# EAGLE design i2c_buffer (EAGLE 9.4.2)
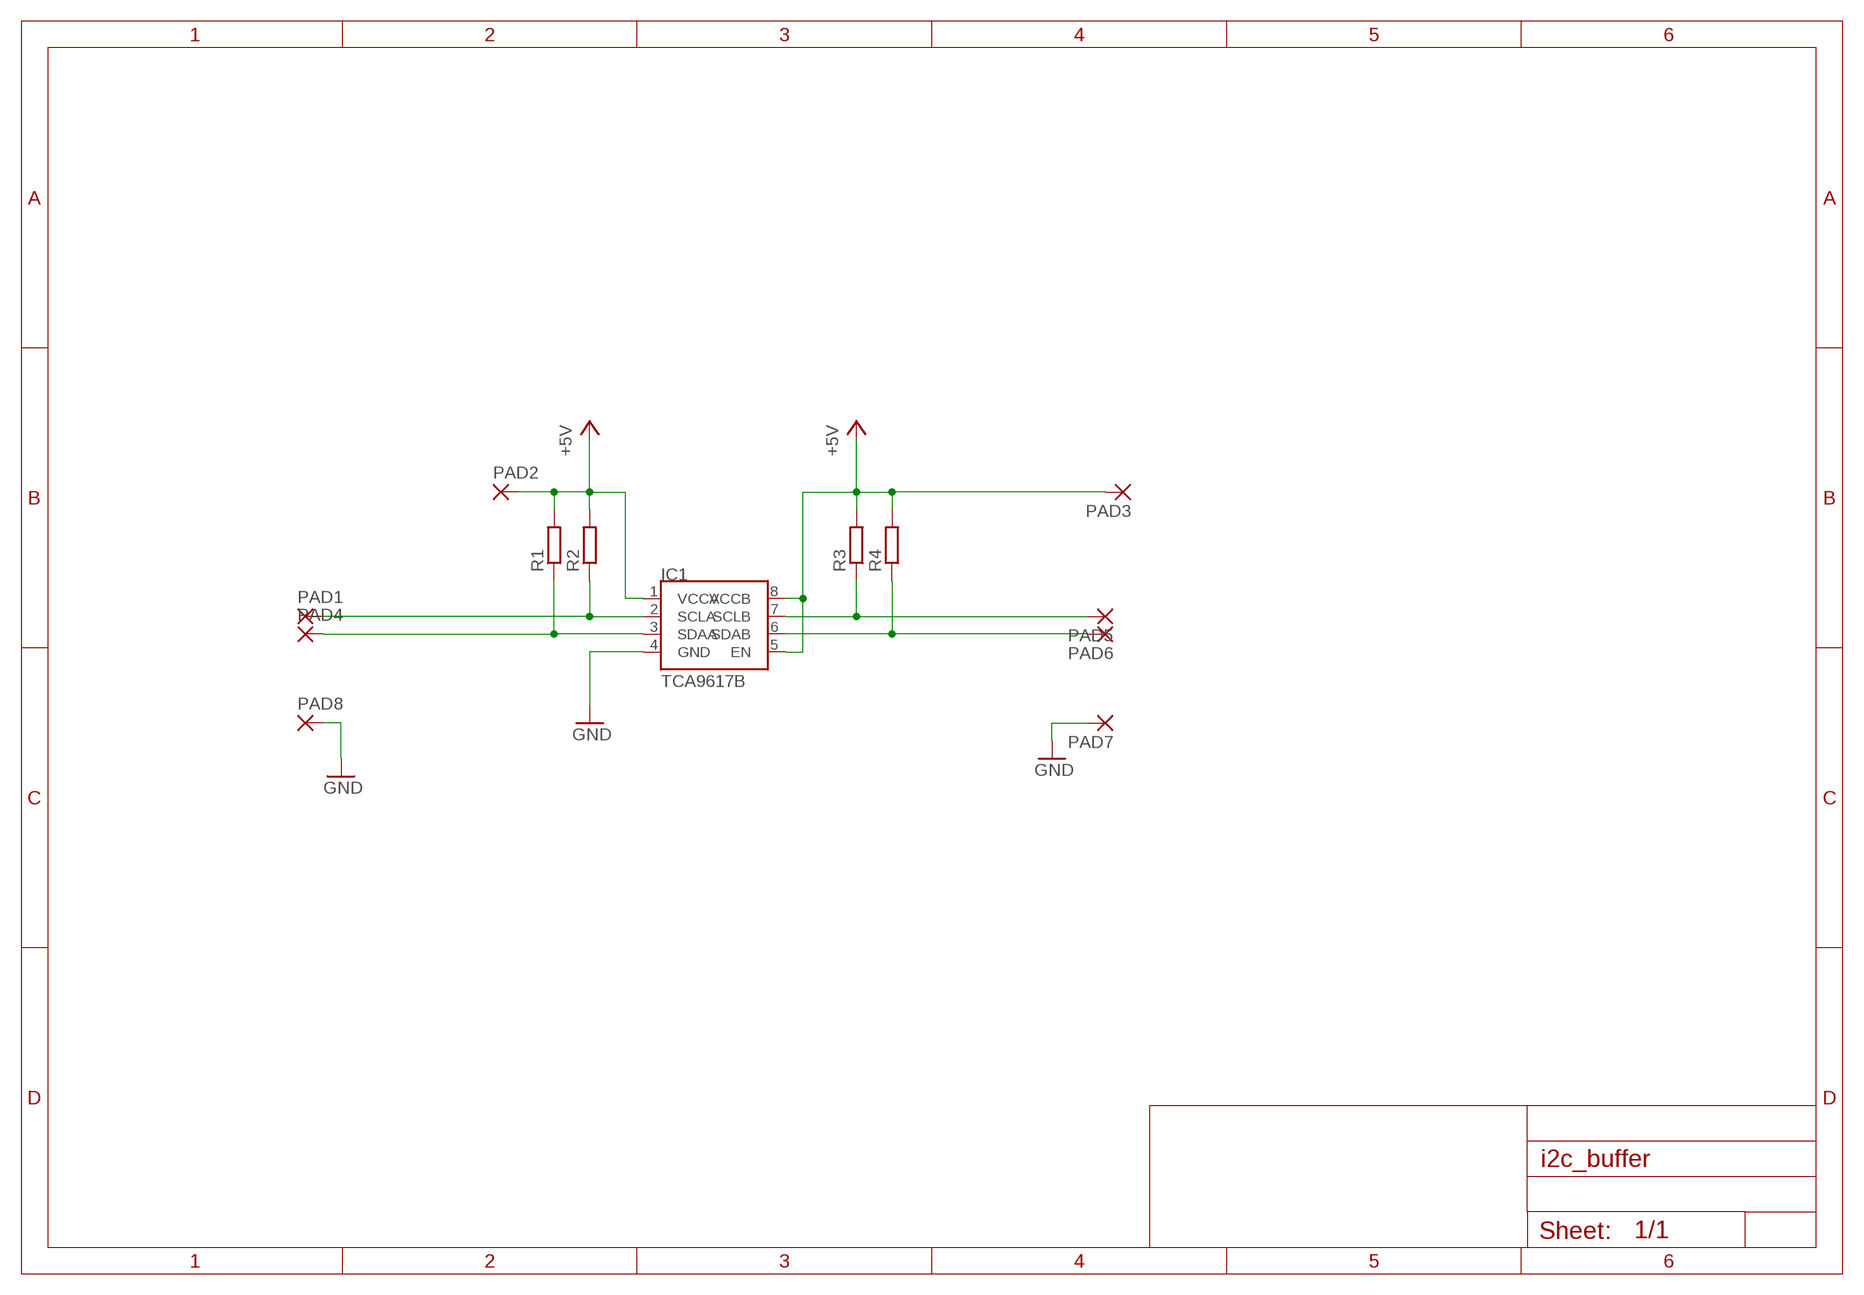
[diagram p0: schematic, sheet 1]

## Parts
IC1  TCA9617B  [VSSOP-8]
PAD1  2,15/1,0  [2,15/1,0]
PAD2  2,15/1,0  [2,15/1,0]
PAD3  2,15/1,0  [2,15/1,0]
PAD4  2,15/1,0  [2,15/1,0]
PAD5  2,15/1,0  [2,15/1,0]
PAD6  2,15/1,0  [2,15/1,0]
PAD7  2,15/1,0  [2,15/1,0]
PAD8  2,15/1,0  [2,15/1,0]
R1  R-EU_R0805  [R0805]
R2  R-EU_R0805  [R0805]
R3  R-EU_R0805  [R0805]
R4  R-EU_R0805  [R0805]

## Nets
+5V: IC1.1(VCCA) IC1.5(EN) IC1.8(VCCB) PAD2.1(P) PAD3.1(P) R1.2 R2.2 R3.2 R4.2
GND: IC1.4(GND) PAD7.1(P) PAD8.1(P)
N$1: IC1.2(SCLA) PAD1.1(P) R2.1
N$2: IC1.3(SDAA) PAD4.1(P) R1.1
N$3: IC1.7(SCLB) PAD5.1(P) R3.1
N$4: IC1.6(SDAB) PAD6.1(P) R4.1

## Library data of the parts
IC1 = solderpi:TCA9617B
PAD1-PAD8 = wirepad:2,15/1,0: THROUGH-HOLE PAD
R1-R4 = rcl:R-EU_: RESISTOR, European symbol; SPICEPREFIX: R

## Board
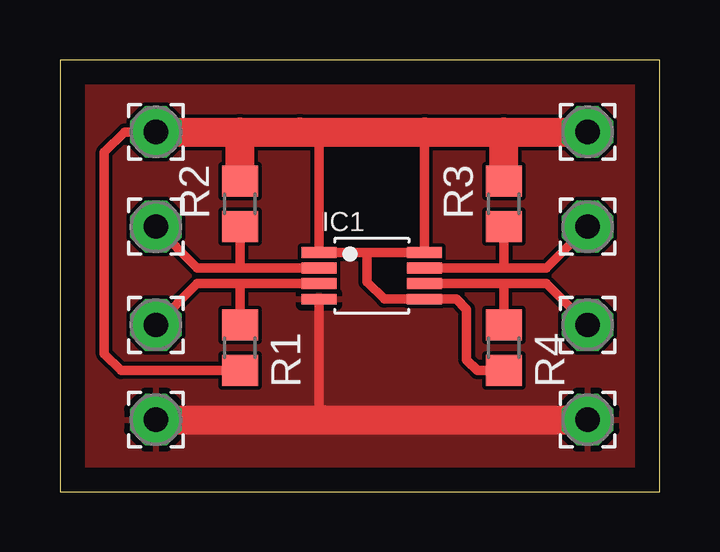
[diagram p1: board, top side]

Size 25 x 18 mm. Coordinates in mm from the lower left corner, seen from the top.
Outline: 0,0 25,0 25,18 0,18 0,0
Copper layers (1*16): Top 0.035mm / dielectric 1.5mm / Bottom 0.035mm
Design rules "default": minimum track width 6mil, minimum drill 0.35mm, track to track 6mil, track to pad 6mil, pad to pad 6mil, via to via 6mil, smd to smd 6mil, copper to edge 40mil, drill to drill 6mil, minimum pad ring 10mil, minimum via ring 8mil, stop-mask expansion 4mil, vias tented up to drill 0mil, thermal gap 10mil

### Footprints (pad centres in the part's own frame; a part is rotated, then mirrored left to right if it is on the bottom)
VSSOP-8 = smd 0.45 x 1.45: 1 -0.975,-2.2; 2 -0.325,-2.2; 3 0.325,-2.2; 4 0.975,-2.2; 5 0.975,2.2; 6 0.325,2.2; 7 -0.325,2.2; 8 -0.975,2.2
2,15/1,0 = drill 1.016 pad 2.159 octagon: 1 0,0
R0805 = smd 1.3 x 1.5: 1 -0.95,0; 2 0.95,0

### Placement (x,y rotation side)
IC1  13,9 270 top
PAD1  4,11.05 0 top
PAD2  4,15 0 top
PAD3  22,15 0 top
PAD4  4,6.95 0 top
PAD5  22,11.05 0 top
PAD6  22,6.95 0 top
PAD7  22,3 0 top
PAD8  4,3 0 top
R1  7.5,6 270 top
R2  7.5,12 90 top
R3  18.5,12 90 top
R4  18.5,6 270 top

### Tracks (layer width: path | path; a pad name or v marks a point on that pad's centre or on a via)
+5V
  Top 0.4: 12.8,9.97 12.8,8.75 13.53,8.03 IC1.5 16.52,8.03 16.95,7.6 16.95,5.5 17.4,5.05 R4.2 | 12.8,9.97 IC1.8 15.2,15 | 12.8,9.97 IC1.1 10.8,15 10,15 | R1.2 2.55,5.05 1.85,5.75 1.85,14.15 2.7,15 PAD2.1
  Top 1.2: PAD2.1 7.5,15 | 7.5,15 10,15 15.2,15 18.5,15 | 18.5,15 PAD3.1 | R2.2 7.5,15 | R3.2 18.5,15
GND
  Top 0.4: IC1.4 10.8,3
  Top 0.5: 10.8,3 11,3
  Top 1.2: PAD8.1 11,3 PAD7.1
  pour Top: 0,18 25,18 25,0 0,0
N$1
  Top 0.4: IC1.2 7.5,9.32 | 7.5,9.32 R2.1 | PAD1.1 5.72,9.32 7.5,9.32
N$2
  Top 0.4: R1.1 7.5,8.68 | 7.5,8.68 IC1.3 | PAD4.1 5.72,8.68 7.5,8.68
N$3
  Top 0.4: PAD5.1 20.27,9.32 18.5,9.32 | IC1.7 18.5,9.32 | R3.1 18.5,9.32
N$4
  Top 0.4: IC1.6 18.5,8.68 | R4.1 18.5,8.68 | 18.5,8.68 20.27,8.68 PAD6.1